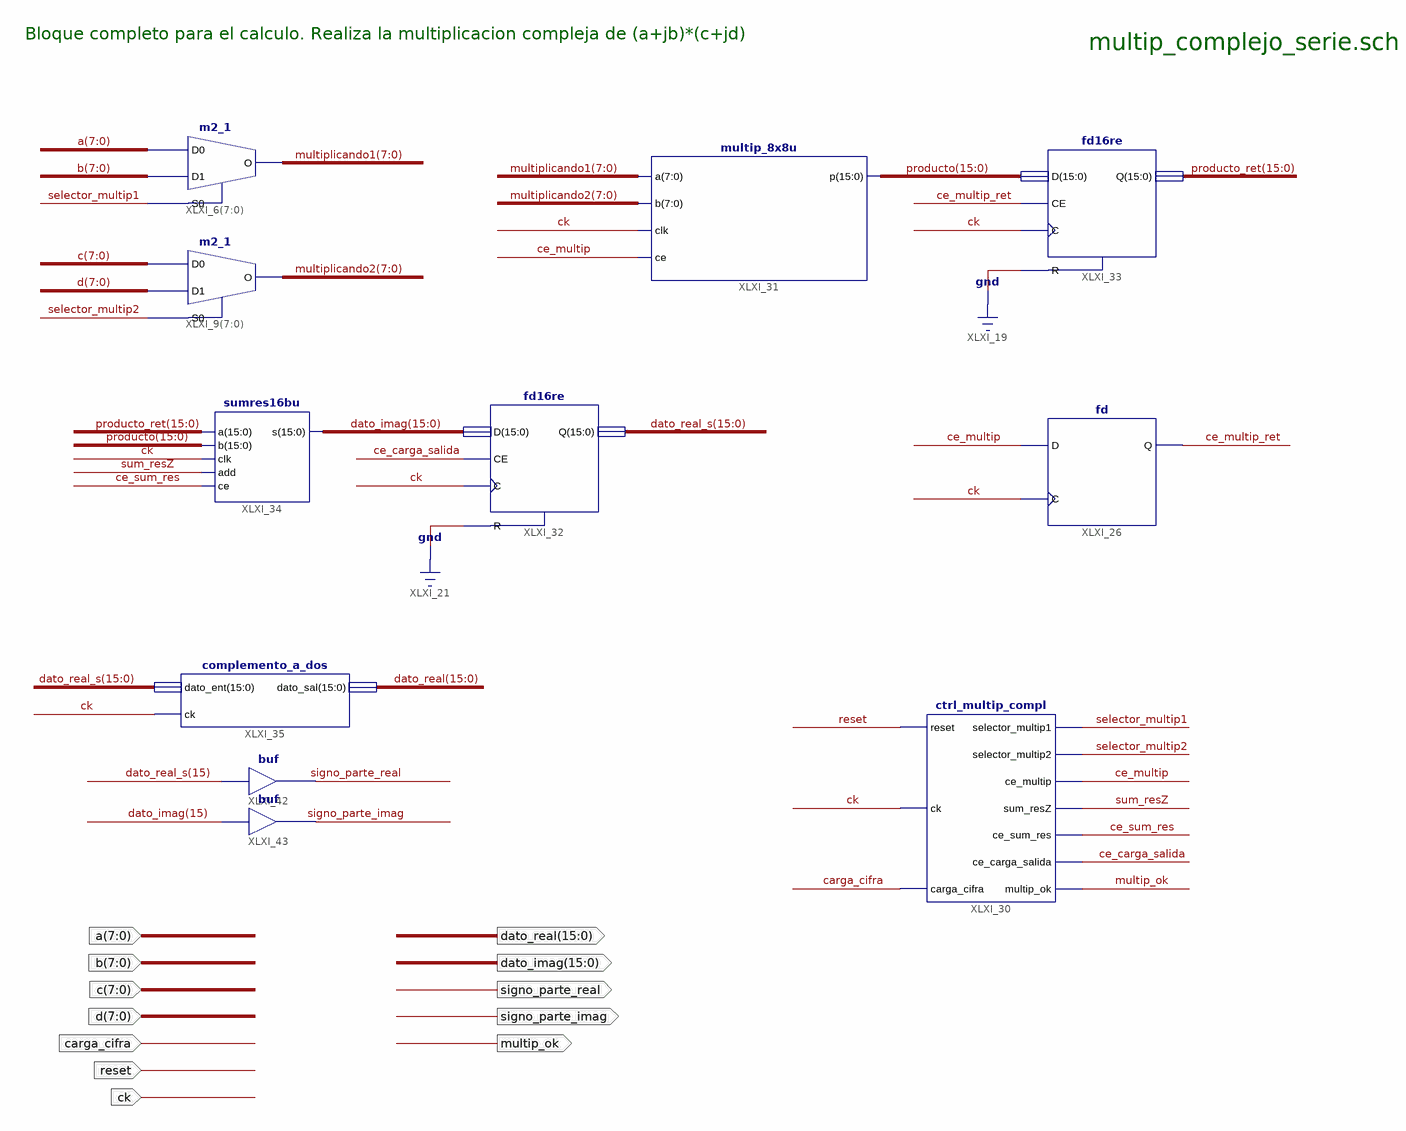
[diagram p0: schematic sheet 1]
// Xilinx ISE schematic multip_complejo_serie.sch (spartan6) as structural Verilog: 11 symbols, 12 ports
module multip_complejo_serie (
  input  reset,
  input  ck,
  input  carga_cifra,
  input  [7:0] a,
  input  [7:0] b,
  input  [7:0] c,
  input  [7:0] d,
  output multip_ok,
  output [15:0] dato_real,
  output [15:0] dato_imag,
  output signo_parte_real,
  output signo_parte_imag
);

  wire ce_carga_salida, ce_multip, ce_multip_ret, ce_sum_res, selector_multip1, selector_multip2, sum_resZ;
  wire [7:0] multiplicando1, multiplicando2;
  wire [15:0] dato_real_s, producto, producto_ret;

  m2_1 XLXI_6[7:0] (.D0(a), .D1(b), .S0(selector_multip1), .O(multiplicando1));
  m2_1 XLXI_9[7:0] (.D0(c), .D1(d), .S0(selector_multip2), .O(multiplicando2));
  fd XLXI_26 (.C(ck), .D(ce_multip), .Q(ce_multip_ret));
  ctrl_multip_compl XLXI_30 (
    .reset(reset), .ck(ck), .carga_cifra(carga_cifra), .selector_multip1(selector_multip1),
    .selector_multip2(selector_multip2), .ce_multip(ce_multip), .sum_resZ(sum_resZ), .ce_sum_res(ce_sum_res),
    .ce_carga_salida(ce_carga_salida), .multip_ok(multip_ok));
  multip_8x8u XLXI_31 (.a(multiplicando1), .b(multiplicando2), .p(producto), .clk(ck), .ce(ce_multip));
  fd16re XLXI_33 (.C(ck), .CE(ce_multip_ret), .D(producto), .R(1'b0), .Q(producto_ret));
  fd16re XLXI_32 (.C(ck), .CE(ce_carga_salida), .D(dato_imag), .R(1'b0), .Q(dato_real_s));
  sumres16bu XLXI_34 (.a(producto_ret), .b(producto), .clk(ck), .add(sum_resZ), .ce(ce_sum_res), .s(dato_imag));
  complemento_a_dos XLXI_35 (.ck(ck), .dato_ent(dato_real_s), .dato_sal(dato_real));
  buf XLXI_42 (signo_parte_real, dato_real_s[15]);
  buf XLXI_43 (signo_parte_imag, dato_imag[15]);

  // Notes on the sheet:
  //   Bloque completo para el calculo. Realiza la multiplicacion compleja de (a+jb)*(c+jd)
  //   multip_complejo_serie.sch
endmodule
